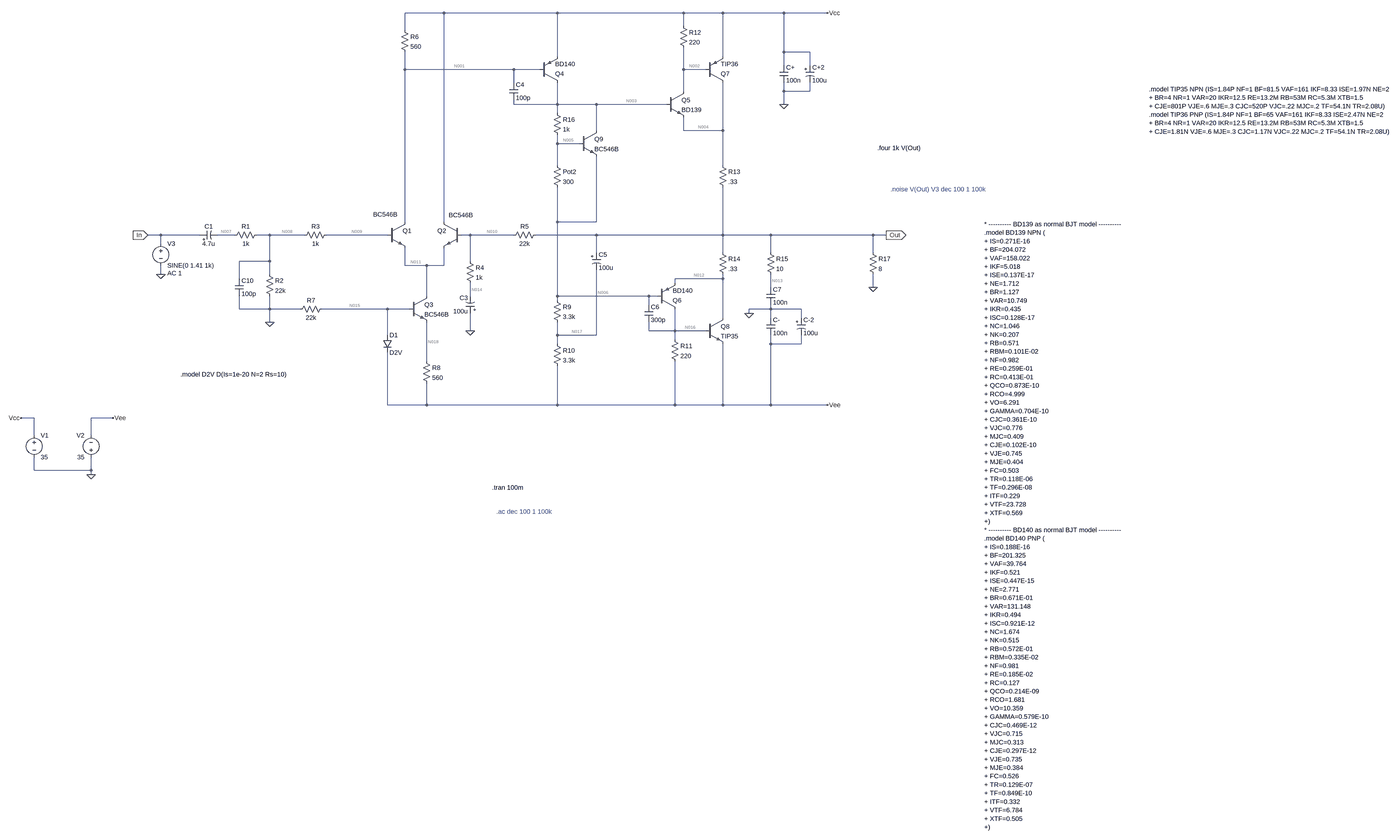
[diagram p0: schematic Draft2.asc, whole sheet]
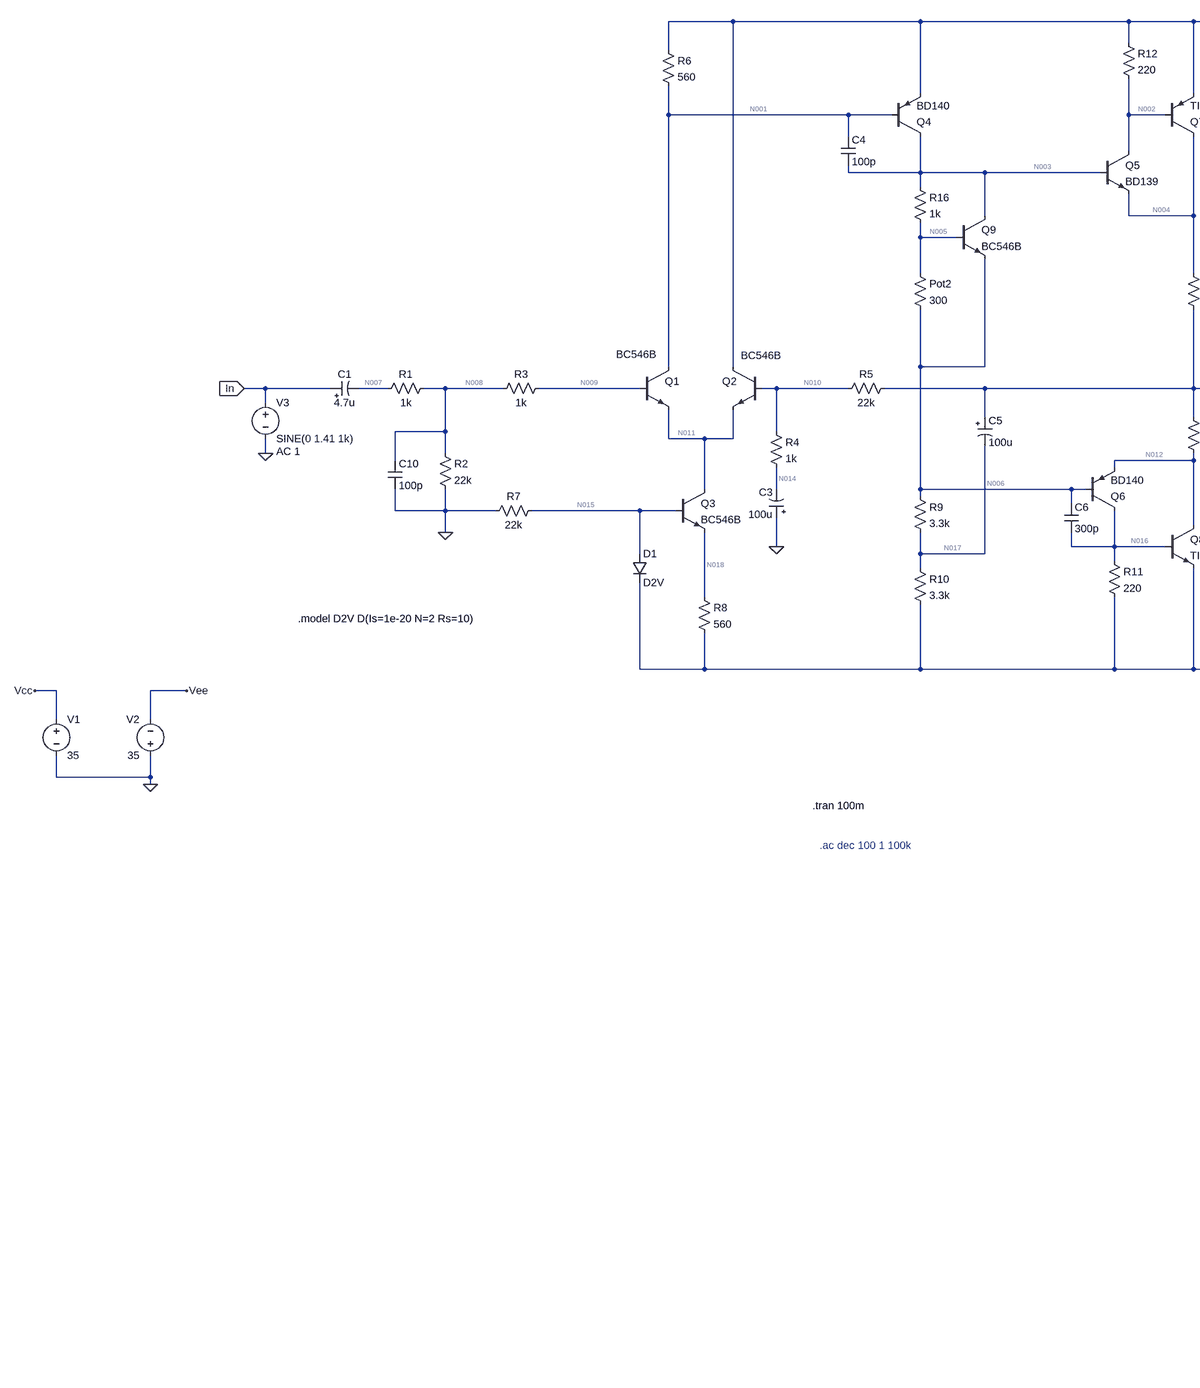
[diagram p1: schematic Draft2.asc, part, row 1 of 1, column 1 of 2]
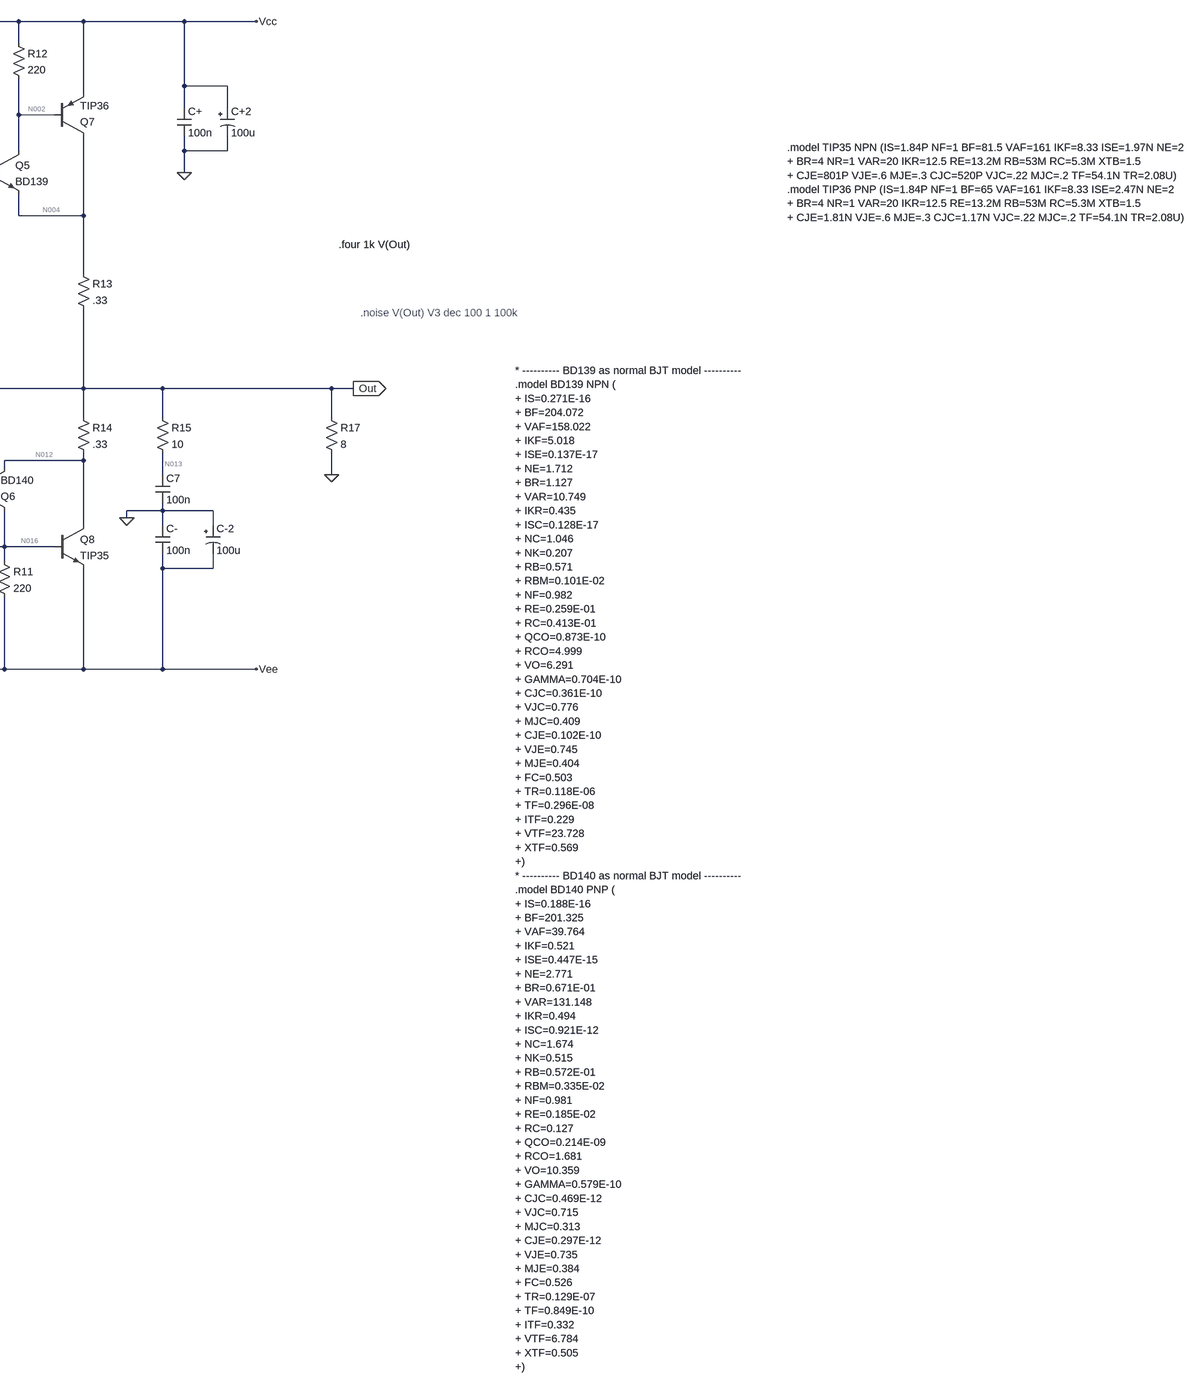
[diagram p2: schematic Draft2.asc, part, row 1 of 1, column 2 of 2]
Draft2.asc, the LTspice schematic file:
Version 4.1
SHEET 1 4200 2636
WIRE -1200 -144 -1344 -144
WIRE -784 -144 -1200 -144
WIRE -320 -144 -784 -144
WIRE -176 -144 -320 -144
WIRE 48 -144 -176 -144
WIRE 208 -144 48 -144
WIRE -320 -96 -320 -144
WIRE -1344 -80 -1344 -144
WIRE 48 0 48 -144
WIRE 144 0 48 0
WIRE -784 16 -784 -144
WIRE -176 16 -176 -144
WIRE 48 48 48 0
WIRE 144 48 144 0
WIRE -1344 64 -1344 0
WIRE -944 64 -1344 64
WIRE -848 64 -944 64
WIRE -320 64 -320 -16
WIRE -240 64 -320 64
WIRE -944 112 -944 64
WIRE -320 144 -320 64
WIRE 48 144 48 112
WIRE 144 144 144 112
WIRE 144 144 48 144
WIRE -944 192 -944 176
WIRE -784 192 -784 112
WIRE -784 192 -944 192
WIRE -640 192 -784 192
WIRE -384 192 -640 192
WIRE 48 192 48 144
WIRE -784 224 -784 192
WIRE -640 288 -640 192
WIRE -320 288 -320 240
WIRE -176 288 -176 112
WIRE -176 288 -320 288
WIRE -784 336 -784 304
WIRE -704 336 -784 336
WIRE -784 416 -784 336
WIRE -176 416 -176 288
WIRE -1344 624 -1344 64
WIRE -1200 624 -1200 -144
WIRE -784 624 -784 496
WIRE -640 624 -640 384
WIRE -640 624 -784 624
WIRE -2240 672 -2288 672
WIRE -2096 672 -2240 672
WIRE -1968 672 -2032 672
WIRE -1840 672 -1888 672
WIRE -1712 672 -1840 672
WIRE -1408 672 -1632 672
WIRE -1104 672 -1136 672
WIRE -944 672 -1104 672
WIRE -640 672 -864 672
WIRE -176 672 -176 496
WIRE -176 672 -640 672
WIRE 0 672 -176 672
WIRE 384 672 0 672
WIRE 432 672 384 672
WIRE -2240 704 -2240 672
WIRE -640 736 -640 672
WIRE -176 736 -176 672
WIRE 0 736 0 672
WIRE 384 736 384 672
WIRE -1840 768 -1840 672
WIRE -1840 768 -1952 768
WIRE -1104 768 -1104 672
WIRE -1344 784 -1344 720
WIRE -1264 784 -1344 784
WIRE -1200 784 -1200 720
WIRE -1200 784 -1264 784
WIRE -2240 816 -2240 784
WIRE -1840 816 -1840 768
WIRE -1952 832 -1952 768
WIRE -176 832 -176 816
WIRE -176 832 -352 832
WIRE -352 848 -352 832
WIRE 0 864 0 816
WIRE 384 864 384 816
WIRE -1264 896 -1264 784
WIRE -1104 896 -1104 848
WIRE -784 896 -784 624
WIRE -448 896 -784 896
WIRE -416 896 -448 896
WIRE -784 912 -784 896
WIRE -448 928 -448 896
WIRE -1952 944 -1952 896
WIRE -1840 944 -1840 896
WIRE -1840 944 -1952 944
WIRE -1728 944 -1840 944
WIRE -1408 944 -1648 944
WIRE -1328 944 -1408 944
WIRE 0 944 0 928
WIRE 0 944 -80 944
WIRE 112 944 0 944
WIRE -80 960 -80 944
WIRE -176 976 -176 832
WIRE 0 976 0 944
WIRE 112 976 112 944
WIRE -1840 992 -1840 944
WIRE -1104 1024 -1104 960
WIRE -448 1024 -448 992
WIRE -352 1024 -352 944
WIRE -352 1024 -448 1024
WIRE -240 1024 -352 1024
WIRE -1408 1040 -1408 944
WIRE -784 1040 -784 992
WIRE -640 1040 -640 800
WIRE -640 1040 -784 1040
WIRE -352 1056 -352 1024
WIRE -784 1072 -784 1040
WIRE 0 1072 0 1040
WIRE 112 1072 112 1040
WIRE 112 1072 0 1072
WIRE -1264 1136 -1264 992
WIRE -1408 1296 -1408 1104
WIRE -1264 1296 -1264 1216
WIRE -1264 1296 -1408 1296
WIRE -784 1296 -784 1152
WIRE -784 1296 -1264 1296
WIRE -352 1296 -352 1136
WIRE -352 1296 -784 1296
WIRE -176 1296 -176 1072
WIRE -176 1296 -352 1296
WIRE 0 1296 0 1072
WIRE 0 1296 -176 1296
WIRE 208 1296 0 1296
WIRE -2720 1344 -2768 1344
WIRE -2416 1344 -2496 1344
WIRE -2720 1408 -2720 1344
WIRE -2496 1408 -2496 1344
WIRE -2720 1536 -2720 1488
WIRE -2496 1536 -2496 1488
WIRE -2496 1536 -2720 1536
WIRE -2496 1552 -2496 1536
FLAG 48 192 0
FLAG 208 -144 Vcc
FLAG -1104 1024 0
FLAG 432 672 Out
IOPIN 432 672 Out
FLAG -80 960 0
FLAG 208 1296 Vee
FLAG -1840 992 0
FLAG -2288 672 In
IOPIN -2288 672 In
FLAG -2496 1552 0
FLAG -2768 1344 Vcc
FLAG -2416 1344 Vee
FLAG -2240 816 0
FLAG 384 864 0
SYMBOL cap 32 48 R0
SYMATTR InstName C+
SYMATTR Value 100n
SYMBOL polcap 128 48 R0
SYMATTR InstName C+2
SYMATTR Value 100u
SYMBOL npn -384 144 R0
SYMATTR InstName Q5
SYMATTR Value BD139
SYMBOL res -336 -112 R0
SYMATTR InstName R12
SYMATTR Value 220
SYMBOL pnp -848 112 M180
SYMATTR InstName Q4
SYMATTR Value BD140
SYMBOL npn -704 288 R0
SYMATTR InstName Q9
SYMATTR Value BC546B
SYMBOL res -800 208 R0
SYMATTR InstName R16
SYMATTR Value 1k
SYMBOL res -800 400 R0
SYMATTR InstName Pot2
SYMATTR Value 300
SYMBOL cap -960 112 R0
SYMATTR InstName C4
SYMATTR Value 100p
SYMBOL res -1360 -96 R0
SYMATTR InstName R6
SYMATTR Value 560
SYMBOL res -192 400 R0
SYMATTR InstName R13
SYMATTR Value .33
SYMBOL res -848 656 R90
WINDOW 0 0 56 VBottom 2
WINDOW 3 32 56 VTop 2
SYMATTR InstName R5
SYMATTR Value 22k
SYMBOL npn -1136 624 M0
WINDOW 3 -42 -25 Left 2
SYMATTR Value BC546B
SYMATTR InstName Q2
SYMBOL npn -1408 624 R0
WINDOW 3 -52 -28 Left 2
SYMATTR Value BC546B
SYMATTR InstName Q1
SYMBOL res -1120 752 R0
SYMATTR InstName R4
SYMATTR Value 1k
SYMBOL res -800 896 R0
SYMATTR InstName R9
SYMATTR Value 3.3k
SYMBOL res -800 1056 R0
SYMATTR InstName R10
SYMATTR Value 3.3k
SYMBOL pnp -416 944 M180
SYMATTR InstName Q6
SYMATTR Value BD140
SYMBOL cap -464 928 R0
SYMATTR InstName C6
SYMATTR Value 300p
SYMBOL res -192 720 R0
SYMATTR InstName R14
SYMATTR Value .33
SYMBOL npn -240 976 R0
SYMATTR InstName Q8
SYMATTR Value TIP35
SYMBOL res -368 1040 R0
SYMATTR InstName R11
SYMATTR Value 220
SYMBOL res -16 720 R0
SYMATTR InstName R15
SYMATTR Value 10
SYMBOL cap -16 864 R0
SYMATTR InstName C7
SYMATTR Value 100n
SYMBOL cap -16 976 R0
SYMATTR InstName C-
SYMATTR Value 100n
SYMBOL npn -1328 896 R0
SYMATTR InstName Q3
SYMATTR Value BC546B
SYMBOL res -1856 800 R0
SYMATTR InstName R2
SYMATTR Value 22k
SYMBOL res -1616 656 R90
WINDOW 0 0 56 VBottom 2
WINDOW 3 32 56 VTop 2
SYMATTR InstName R3
SYMATTR Value 1k
SYMBOL cap -1968 832 R0
SYMATTR InstName C10
SYMATTR Value 100p
SYMBOL res -1872 656 R90
WINDOW 0 0 56 VBottom 2
WINDOW 3 32 56 VTop 2
SYMATTR InstName R1
SYMATTR Value 1k
SYMBOL polcap -1088 960 R180
WINDOW 0 24 57 Left 2
WINDOW 3 24 8 Left 2
SYMATTR InstName C3
SYMATTR Value 100u
SYMBOL polcap -656 736 R0
SYMATTR InstName C5
SYMATTR Value 100u
SYMBOL polcap 96 976 R0
SYMATTR InstName C-2
SYMATTR Value 100u
SYMBOL voltage -2720 1392 R0
WINDOW 123 0 0 Left 0
WINDOW 39 0 0 Left 0
SYMATTR InstName V1
SYMATTR Value 35
SYMBOL voltage -2496 1504 R180
WINDOW 0 24 96 Left 2
WINDOW 3 24 16 Left 2
WINDOW 123 0 0 Left 0
WINDOW 39 0 0 Left 0
SYMATTR InstName V2
SYMATTR Value 35
SYMBOL voltage -2240 688 R0
WINDOW 123 24 124 Left 2
WINDOW 39 0 0 Left 0
SYMATTR Value2 AC 1
SYMATTR InstName V3
SYMATTR Value SINE(0 1.41 1k)
SYMBOL res 368 720 R0
SYMATTR InstName R17
SYMATTR Value 8
SYMBOL pnp -240 112 M180
SYMATTR InstName Q7
SYMATTR Value TIP36
SYMBOL polcap -2096 688 R270
WINDOW 0 32 32 VTop 2
WINDOW 3 0 32 VBottom 2
SYMATTR InstName C1
SYMATTR Value 4.7u
SYMBOL res -1632 928 R90
WINDOW 0 0 56 VBottom 2
WINDOW 3 32 56 VTop 2
SYMATTR InstName R7
SYMATTR Value 22k
SYMBOL res -1280 1120 R0
SYMATTR InstName R8
SYMATTR Value 560
SYMBOL diode -1424 1040 R0
SYMATTR InstName D1
SYMATTR Value D2V
TEXT -1024 1600 Left 2 !.tran 100m
TEXT 1424 136 Left 2 !.model TIP35 NPN (IS=1.84P NF=1 BF=81.5 VAF=161 IKF=8.33 ISE=1.97N NE=2\n+ BR=4 NR=1 VAR=20 IKR=12.5 RE=13.2M RB=53M RC=5.3M XTB=1.5\n+ CJE=801P VJE=.6 MJE=.3 CJC=520P VJC=.22 MJC=.2 TF=54.1N TR=2.08U)\n.model TIP36 PNP (IS=1.84P NF=1 BF=65 VAF=161 IKF=8.33 ISE=2.47N NE=2\n+ BR=4 NR=1 VAR=20 IKR=12.5 RE=13.2M RB=53M RC=5.3M XTB=1.5\n+ CJE=1.81N VJE=.6 MJE=.3 CJC=1.17N VJC=.22 MJC=.2 TF=54.1N TR=2.08U)
TEXT 792 632 Left 2 !* ---------- BD139 as normal BJT model ----------\n.model BD139 NPN (\n+ IS=0.271E-16\n+ BF=204.072\n+ VAF=158.022\n+ IKF=5.018\n+ ISE=0.137E-17\n+ NE=1.712\n+ BR=1.127\n+ VAR=10.749\n+ IKR=0.435\n+ ISC=0.128E-17\n+ NC=1.046\n+ NK=0.207\n+ RB=0.571\n+ RBM=0.101E-02\n+ NF=0.982\n+ RE=0.259E-01\n+ RC=0.413E-01\n+ QCO=0.873E-10\n+ RCO=4.999\n+ VO=6.291\n+ GAMMA=0.704E-10\n+ CJC=0.361E-10\n+ VJC=0.776\n+ MJC=0.409\n+ CJE=0.102E-10\n+ VJE=0.745\n+ MJE=0.404\n+ FC=0.503\n+ TR=0.118E-06\n+ TF=0.296E-08\n+ ITF=0.229\n+ VTF=23.728\n+ XTF=0.569\n+)\n* ---------- BD140 as normal BJT model ----------\n.model BD140 PNP (\n+ IS=0.188E-16\n+ BF=201.325\n+ VAF=39.764\n+ IKF=0.521\n+ ISE=0.447E-15\n+ NE=2.771\n+ BR=0.671E-01\n+ VAR=131.148\n+ IKR=0.494\n+ ISC=0.921E-12\n+ NC=1.674\n+ NK=0.515\n+ RB=0.572E-01\n+ RBM=0.335E-02\n+ NF=0.981\n+ RE=0.185E-02\n+ RC=0.127\n+ QCO=0.214E-09\n+ RCO=1.681\n+ VO=10.359\n+ GAMMA=0.579E-10\n+ CJC=0.469E-12\n+ VJC=0.715\n+ MJC=0.313\n+ CJE=0.297E-12\n+ VJE=0.735\n+ MJE=0.384\n+ FC=0.526\n+ TR=0.129E-07\n+ TF=0.849E-10\n+ ITF=0.332\n+ VTF=6.784\n+ XTF=0.505\n+)
TEXT -1008 1688 Left 2 ;.ac dec 100 1 100k
TEXT 448 504 Left 2 ;.noise V(Out) V3 dec 100 1 100k
TEXT 400 352 Left 2 !.four 1k V(Out)
TEXT -2168 1184 Left 2 !.model D2V D(Is=1e-20 N=2 Rs=10)

The netlist it stands for:
* Draft2.asc
C+ Vcc 0 100n
C+2 Vcc 0 100u
Q5 N002 N003 N004 0 BD139
R12 Vcc N002 220
Q4 N003 N001 Vcc 0 BD140
Q9 N003 N005 N006 0 BC546B
R16 N003 N005 1k
R§Pot2 N005 N006 300
C4 N001 N003 100p
R6 Vcc N001 560
R13 N004 Out .33
R5 Out N010 22k
Q2 Vcc N010 N011 0 BC546B
Q1 N001 N009 N011 0 BC546B
R4 N010 N014 1k
R9 N006 N017 3.3k
R10 N017 Vee 3.3k
Q6 N016 N006 N012 0 BD140
C6 N006 N016 300p
R14 Out N012 .33
Q8 N012 N016 Vee 0 TIP35
R11 N016 Vee 220
R15 Out N013 10
C7 N013 0 100n
C- 0 Vee 100n
Q3 N011 N015 N018 0 BC546B
R2 N008 0 22k
R3 N009 N008 1k
C10 N008 0 100p
R1 N008 N007 1k
C3 0 N014 100u
C5 Out N017 100u
C-2 0 Vee 100u
V1 Vcc 0 35
V2 0 Vee 35
V3 In 0 SINE(0 1.41 1k) AC 1
R17 Out 0 8
Q7 N004 N002 Vcc 0 TIP36
C1 In N007 4.7u
R7 N015 0 22k
R8 N018 Vee 560
D1 N015 Vee D2V
.model D D
.lib standard.dio
.model NPN NPN
.model PNP PNP
.lib standard.bjt
.tran 100m
.model TIP35 NPN (IS=1.84P NF=1 BF=81.5 VAF=161 IKF=8.33 ISE=1.97N NE=2
+ BR=4 NR=1 VAR=20 IKR=12.5 RE=13.2M RB=53M RC=5.3M XTB=1.5
+ CJE=801P VJE=.6 MJE=.3 CJC=520P VJC=.22 MJC=.2 TF=54.1N TR=2.08U)
.model TIP36 PNP (IS=1.84P NF=1 BF=65 VAF=161 IKF=8.33 ISE=2.47N NE=2
+ BR=4 NR=1 VAR=20 IKR=12.5 RE=13.2M RB=53M RC=5.3M XTB=1.5
+ CJE=1.81N VJE=.6 MJE=.3 CJC=1.17N VJC=.22 MJC=.2 TF=54.1N TR=2.08U)
* ---------- BD139 as normal BJT model ----------
.model BD139 NPN (
+ IS=0.271E-16
+ BF=204.072
+ VAF=158.022
+ IKF=5.018
+ ISE=0.137E-17
+ NE=1.712
+ BR=1.127
+ VAR=10.749
+ IKR=0.435
+ ISC=0.128E-17
+ NC=1.046
+ NK=0.207
+ RB=0.571
+ RBM=0.101E-02
+ NF=0.982
+ RE=0.259E-01
+ RC=0.413E-01
+ QCO=0.873E-10
+ RCO=4.999
+ VO=6.291
+ GAMMA=0.704E-10
+ CJC=0.361E-10
+ VJC=0.776
+ MJC=0.409
+ CJE=0.102E-10
+ VJE=0.745
+ MJE=0.404
+ FC=0.503
+ TR=0.118E-06
+ TF=0.296E-08
+ ITF=0.229
+ VTF=23.728
+ XTF=0.569
+)
* ---------- BD140 as normal BJT model ----------
.model BD140 PNP (
+ IS=0.188E-16
+ BF=201.325
+ VAF=39.764
+ IKF=0.521
+ ISE=0.447E-15
+ NE=2.771
+ BR=0.671E-01
+ VAR=131.148
+ IKR=0.494
+ ISC=0.921E-12
+ NC=1.674
+ NK=0.515
+ RB=0.572E-01
+ RBM=0.335E-02
+ NF=0.981
+ RE=0.185E-02
+ RC=0.127
+ QCO=0.214E-09
+ RCO=1.681
+ VO=10.359
+ GAMMA=0.579E-10
+ CJC=0.469E-12
+ VJC=0.715
+ MJC=0.313
+ CJE=0.297E-12
+ VJE=0.735
+ MJE=0.384
+ FC=0.526
+ TR=0.129E-07
+ TF=0.849E-10
+ ITF=0.332
+ VTF=6.784
+ XTF=0.505
+)
* .ac dec 100 1 100k
* .noise V(Out) V3 dec 100 1 100k
.four 1k V(Out)
.model D2V D(Is=1e-20 N=2 Rs=10)
.backanno
.end

* Results of the author's LTspice run, read from the files saved beside the schematic
* Operating Point, zero values left out:
*   V(n001) = 34.17 V
*   V(n002) = 34.26 V
*   V(n003) = 1.412 V
*   V(n004) = 532.8 mV
*   V(n005) = -816.9 mV
*   V(n006) = -1.483 V
*   V(n007) = -74.81 mV
*   V(n008) = -74.81 mV
*   V(n009) = -78.21 mV
*   V(n010) = -88.97 mV
*   V(n011) = -716.3 mV
*   V(n012) = -612.3 mV
*   V(n013) = -38.95 mV
*   V(n014) = -88.97 mV
*   V(n015) = -32.94 V
*   V(n016) = -34.26 V
*   V(n017) = -18.24 V
*   V(n018) = -33.59 V
*   V(out) = -38.95 mV
*   V(vcc) = 35 V
*   V(vee) = -35 V
*   I(D1) = 1.491 mA
*   I(Pot2) = 2.219 mA
*   I(R10) = 5.078 mA
*   I(R11) = 3.35 mA
*   I(R12) = 3.35 mA
*   I(R13) = 1.732 A
*   I(R14) = 1.737 A
*   I(R16) = 2.229 mA
*   I(R17) = -4.869 mA
*   I(R2) = -3.4 µA
*   I(R3) = -3.4 µA
*   I(R5) = 2.273 µA
*   I(R6) = 1.479 mA
*   I(R7) = -1.497 mA
*   I(R8) = 2.514 mA
*   I(R9) = 5.078 mA
*   I(V1) = -1.74 A
*   I(V2) = -1.746 A
*   Ib(Q1) = 3.4 µA
*   Ib(Q2) = 2.273 µA
*   Ib(Q3) = 5.856 µA
*   Ib(Q4) = -14.14 µA
*   Ib(Q5) = 139.2 µA
*   Ib(Q6) = -73.91 µA
*   Ib(Q7) = -28.54 mA
*   Ib(Q8) = 22.93 mA
*   Ib(Q9) = 9.592 µA
*   Ic(Q1) = 1.494 mA
*   Ic(Q2) = 1.009 mA
*   Ic(Q3) = 2.508 mA
*   Ic(Q4) = -5.144 mA
*   Ic(Q5) = 31.89 mA
*   Ic(Q6) = -26.28 mA
*   Ic(Q7) = -1.7 A
*   Ic(Q8) = 1.711 A
*   Ic(Q9) = 2.775 mA
*   Ie(Q1) = -1.497 mA
*   Ie(Q2) = -1.011 mA
*   Ie(Q3) = -2.514 mA
*   Ie(Q4) = 5.158 mA
*   Ie(Q5) = -32.03 mA
*   Ie(Q6) = 26.35 mA
*   Ie(Q7) = 1.729 A
*   Ie(Q8) = -1.734 A
*   Ie(Q9) = -2.785 mA
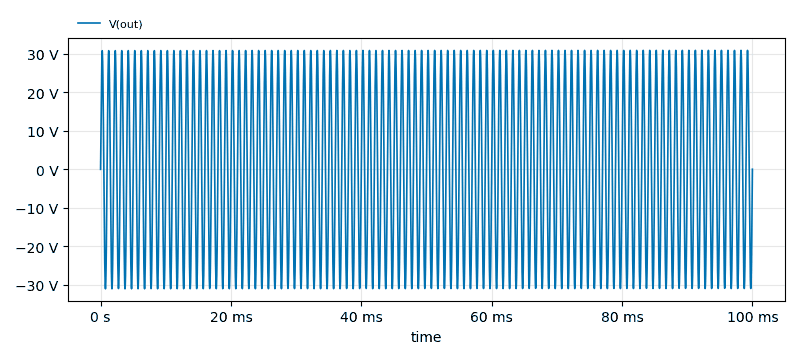
[diagram p3: Transient Analysis of Draft2.asc, plotted from the saved traces]
* Transient Analysis, 1 run:
*   V(out): min -31.11 V, max 30.9 V, average -90.58 mV, rms 22.05 V, last -9.673 mV
* From the log:
*   Fourier components of V(Out)
*   N-Period=1
*   DC component:-0.0583022
*   Harmonic  Frequency   Fourier   Normalized   Phase    Normalized
*    Number     [Hz]     Component   Component  [degree]  Phase [deg]
*       1      1.000e+03   3.091e+01   1.000e+00     89.99°      0.00°
*       2      2.000e+03   2.530e-02   8.186e-04    -70.95°   -160.93°
*       3      3.000e+03   7.278e-02   2.355e-03    -76.35°   -166.33°
*       4      4.000e+03   2.360e-02   7.634e-04    -96.32°   -186.31°
*       5      5.000e+03   4.429e-02   1.433e-03    -25.98°   -115.96°
*       6      6.000e+03   8.651e-03   2.799e-04   -108.78°   -198.77°
*       7      7.000e+03   2.584e-02   8.360e-04     99.74°      9.75°
*       8      8.000e+03   1.615e-03   5.224e-05    131.52°     41.53°
*       9      9.000e+03   8.393e-03   2.715e-04    178.42°     88.44°
*   Partial Harmonic Distortion: 0.311524%
*   Total Harmonic Distortion:   0.373854%